# Altium schematic sheet Display.SchDoc
size A4; SheetNumber: 14; SheetTotal: 15
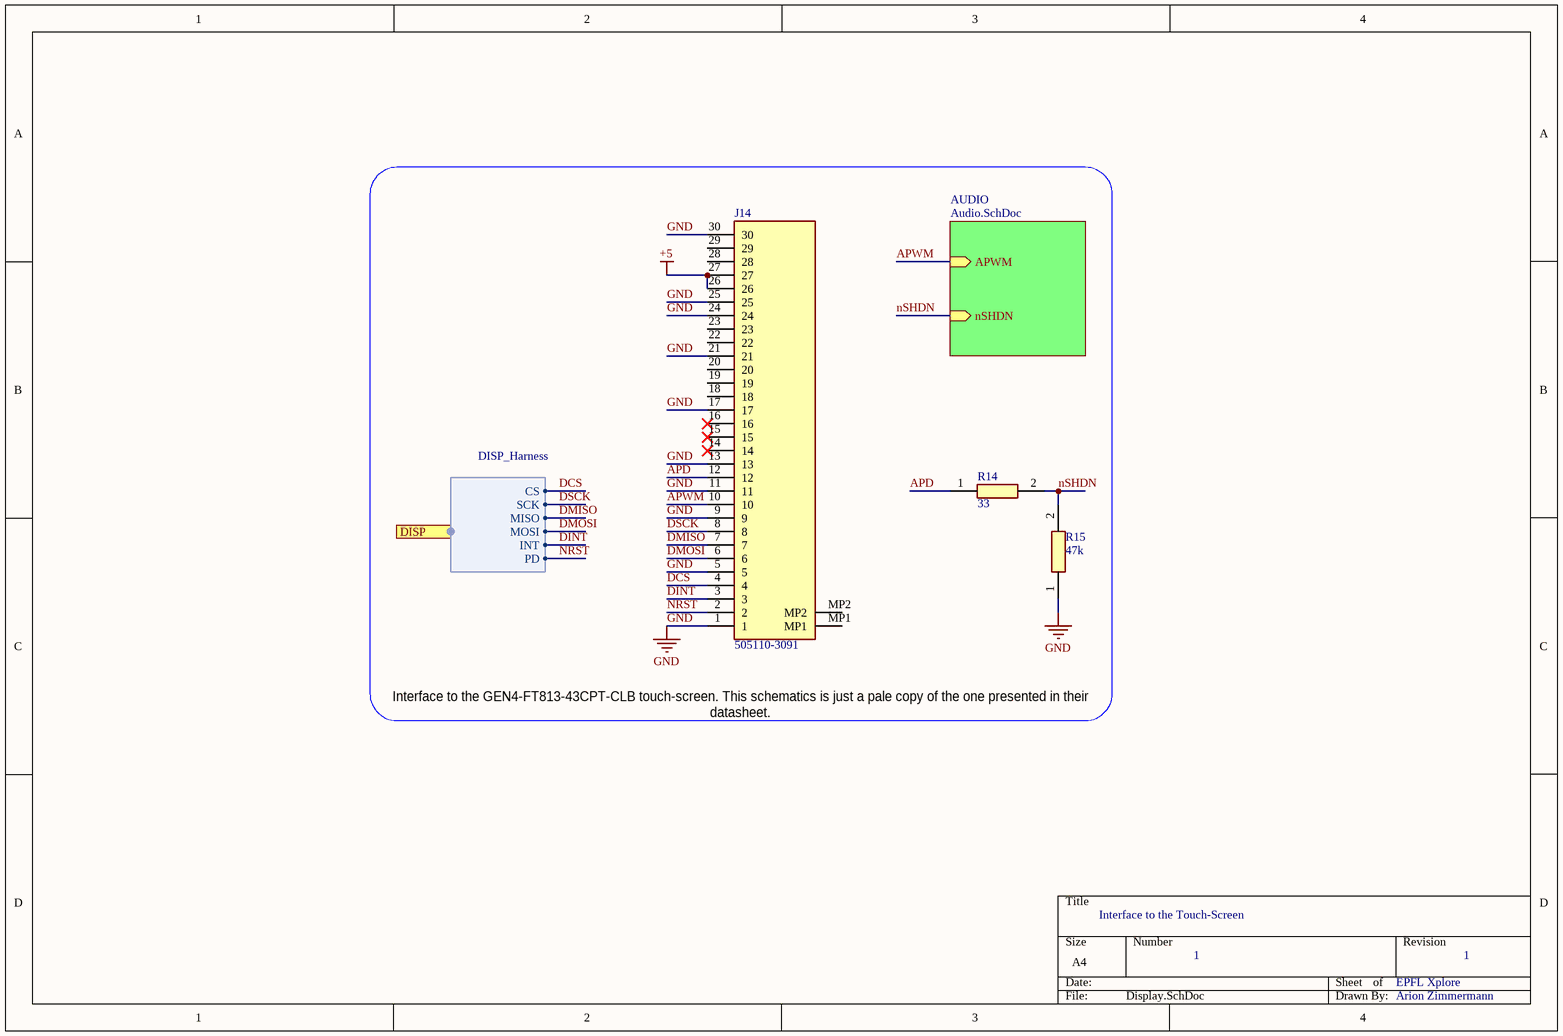
[diagram p0: Display.SchDoc]

## Parts
J14  505110-3091  [5051103091]
R14  value 33  [RESC1608X50N]  (hidden comment: CRCW060333R0JNEAC)
R15  value 47k  [RESC1608X50N]  (hidden comment: CRCW060347K0FKEAC)

## Sub-sheets
AUDIO = Audio.SchDoc: APWM (in), nSHDN (in)

## Ports
DISP (harness DISP_Harness)

## Harnesses
DISP_Harness: CS, MISO, SCK, MOSI, INT, PD

## Nets
+5: J14.26 J14.27
GND: J14.1 J14.5 J14.9 J14.11 J14.13 J14.17 J14.21 J14.24 J14.25 J14.30 R15.1
APD: J14.12 R14.1
APWM: J14.10 ; sheet AUDIO/APWM
DCS: J14.4 ; port DISP.CS
DINT: J14.3 ; port DISP.INT
DMISO: J14.7 ; port DISP.MISO
DMOSI: J14.6 ; port DISP.MOSI
DSCK: J14.8 ; port DISP.SCK
NRST: J14.2 ; port DISP.PD
nSHDN: R14.2 R15.2 ; sheet AUDIO/nSHDN

Not connected (* = marked no-connect by the designer): J14 14* 15* 16* 18 19 20 22 23 28 29 MP1 MP2

## Notes on the sheet
- Interface to the GEN4-FT813-43CPT-CLB touch-screen. This schematics is just a pale copy of the one presented in their datasheet.
- Interface to the Touch-Screen
- 1
- EPFL Xplore
- Arion Zimmermann

## Library data of the parts
J14 = 505110-3091: Connector; Manufacturer_Name: Molex; Datasheet Link: https://www.molex.com/pdm_docs/sd/5051103091_sd.pdf; Height: 2.1mm; Manufacturer_Part_Number: 505110-3091; Mouser Part Number: 538-505110-3091; Mouser Price/Stock: https://www.mouser.co.uk/ProductDetail/Molex/505110-3091?qs=fSIr1QPo%2F%2FSZ9fkf9Qvqqg%3D%3D
R14 R15 = CRCW0603931RFKEA: Resistor; Manufacturer_Name: Vishay; Manufacturer_Part_Number: CRCW0603787RFKEA; Datasheet Link: http://www.vishay.com/docs/20035/dcrcwe3.pdf; Height: 0.5mm; Supplier 1: Mouser; Supplier Part Number 1: 71-CRCW06032K00JNEB